# Altium schematic sheet Smartfin Main PCBA Motion.SchDoc: Motion
size Tabloid; TOCFontName: Consolas; TOCFontSize: 24; TOCFontColor: 0; TOCFontAttributes: 0; TOCMaxLinesInTable: 25; TOCVerticalOffset: 200; TOCHorizontalOffset: 500; TOCHorizontalSeparation: 800; TOCVerticalSeparation: 30; TOCHorizTableSize: 640; Engineer: Amy Domino; DocumentNumber: 644-001-023; Revision: A; SheetNumber: 4; SheetTotal: 9; PageSetup: Record=PageOptions|CenterHorizontal=True|CenterVertical=True|PrintScale=0.96|XCorrection=1.00|YCorrection=1.00|PrintKind=0|BorderSize=5000000|LeftOffset=0|BottomOffset=0|Orientation=2|PaperLength=1000|PaperWidth=1000|Scale=100|PaperSource=7|PrintQuality=-4|MediaType=1|DitherType=10|PaperKind=11" x 17"|PrintScaleMode=1
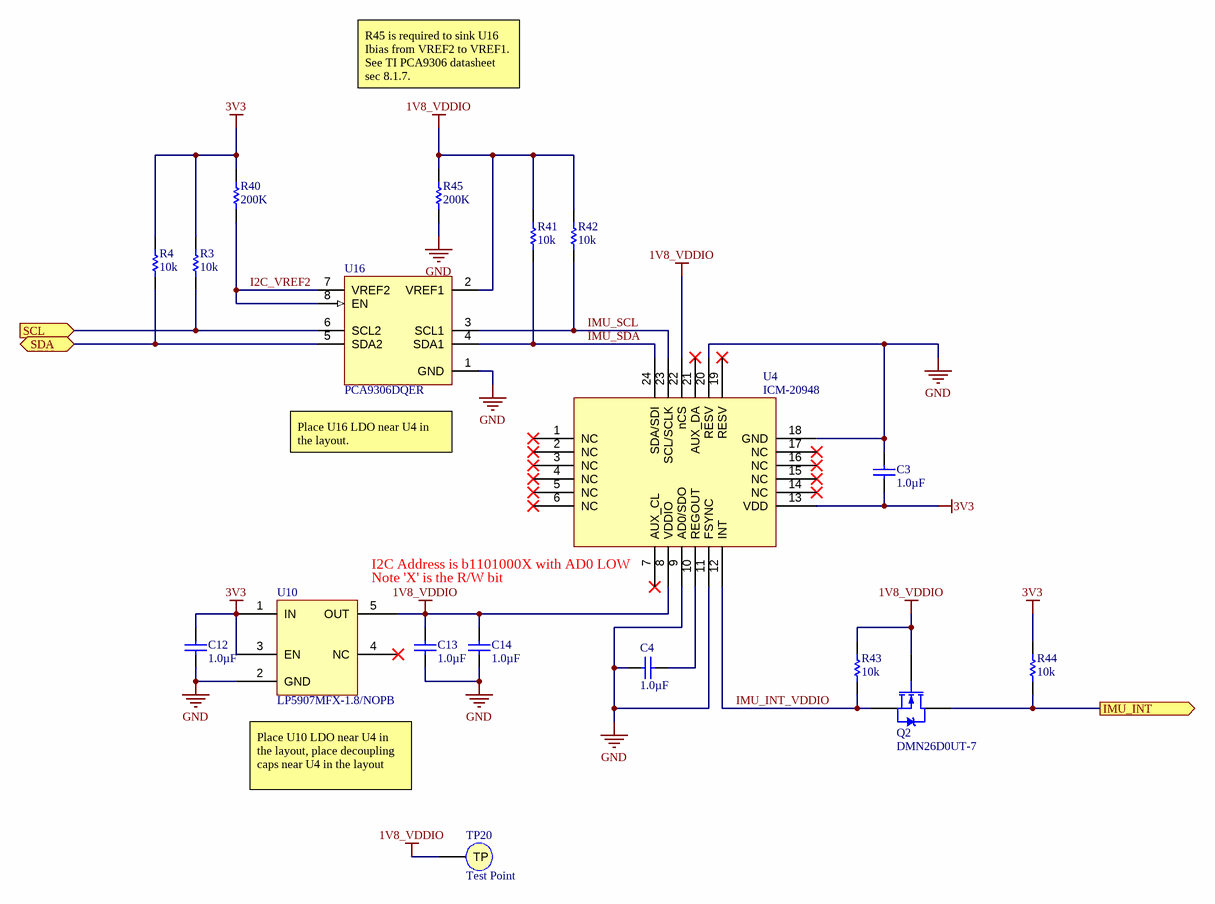
[diagram p0: Smartfin Main PCBA Motion.SchDoc]

## Parts
C3  1.0µF  [CAPC0402(1005)60_N]
C4  1.0µF  [CAPC0402(1005)60_N]
C12  1.0µF  [CAPC0402(1005)60_N]
C13  1.0µF  [CAPC0402(1005)60_N]
C14  1.0µF  [CAPC0402(1005)60_N]
Q2  DMN26D0UT-7  [DMN26D0UT-7-Footprint-1]
R3  10k  [RESC0402(1005)_N]
R4  10k  [RESC0402(1005)_N]
R40  200K  [RESC0402(1005)_N]
R41  10k  [RESC0402(1005)_N]
R42  10k  [RESC0402(1005)_N]
R43  10k  [RESC0402(1005)_N]
R44  10k  [RESC0402(1005)_N]
R45  200K  [RESC0402(1005)_N]
TP20  Test Point  [TESTPAD_ICT]  (no BOM)
U4  ICM-20948  [ICM-20948-Footprint-1]
U10  LP5907MFX-1.8/NOPB  [SOT95P280X145-5N]
U16  PCA9306DQER  [QFN35P100X140X40-8L]

## Ports
IMU_INT (out), SCL (in), SDA (bidir)

## Nets
1V8_VDDIO: C13.2 C14.2 Q2.G R41.2 R42.2 R43.2 R45.2 TP20.1(TP) U4.8(VDDIO) U4.22(nCS) U10.5(OUT) U16.2(VREF1)
3V3: C3.1 C12.2 R3.2 R4.2 R40.2 R44.2 U4.13(VDD) U10.1(IN) U10.3(EN)
GND: C3.2 C4.1 C12.1 C13.1 C14.1 R45.1 U4.9(AD0/SDO) U4.11(FSYNC) U4.18(GND) U4.20(RESV) U10.2(GND) U16.1(GND)
I2C_VREF2: R40.1 U16.7(VREF2) U16.8(EN)
IMU_INT: Q2.D R44.1 ; port IMU_INT
IMU_INT_VDDIO: Q2.S R43.1 U4.12(INT)
IMU_SCL: R42.1 U4.23(SCL/SCLK) U16.3(SCL1)
IMU_SDA: R41.1 U4.24(SDA/SDI) U16.4(SDA1)
SCL: R3.1 U16.6(SCL2) ; port SCL
SDA: R4.1 U16.5(SDA2) ; port SDA
NetC4_2: C4.2 U4.10(REGOUT)

Not connected (* = marked no-connect by the designer): U4 1(NC)* 2(NC)* 3(NC)* 4(NC)* 5(NC)* 6(NC)* 7(AUX_CL)* 14(NC)* 15(NC)* 16(NC)* 17(NC)* 19(RESV)* 21(AUX_DA)*; U10 4(NC)*

## Notes on the sheet
- R45 is required to sink U16 Ibias from VREF2 to VREF1. See TI PCA9306 datasheet sec 8.1.7.
- (near U16) Place U16 LDO near U4 in the layout.
- (near U4) I2C Address is b1101000X with AD0 LOW
- Note 'X' is the R/W bit
- (near U10) Place U10 LDO near U4 in the layout, place decoupling caps near U4 in the layout
- TITLE
- DOC NUMBER
- VARIANT
- REV
- 10875 dover st, suite 500
  westminster, co, 80021, usa
  syncroness.com
- FILE
- ENGINEER
- SHEET
- DATE
- OF
- THIS DOCUMENT IS CONFIDENTIAL AND THE PROPERTY OF SYNCRONESS, INC. AND ITS SUBSIDARIES. IT SHALL NOT BE REPRODUCED IN ANY MANNER NOR USED FOR ANY PURPOSE WHATSOEVER EXCEPT AS SPECIFIED IN WRITING BY SYNCRONESS, INC.

## Library data of the parts
C3 C4 C12-C14 = CMP-13694-A.6: CAP CER 1UF 10V 10% X5R 0402; Manufacturer: Yageo; Manufacturer Part Number: CC0402KRX5R6BB105; Manufacturer 2: Samsung Electro-Mechanics; Manufacturer 3: AVX Corporation; Manufacturer Part Number 2: CL05A105KP5NNNC; Manufacturer Part Number 3: 0402ZD105KAT2A; Operating Temperature: -55°C ~ 85°C; Supplier Part Number 1: 311-1439-1-ND; Supplier Part Number 2: 1276-1076-1-ND; Supplier Part Number 3: 478-4596-1-ND; Temperature Coefficient: X5R; Tolerance: ±10%; Capacitance: 1.0µF; Voltage - Rated: 10V; Supplier 2: Digi-Key; Supplier 3: Digi-Key; Supplier 1: Digi-Key; Datasheet: http://www.samsungsem.com/kr/support/product-search/mlcc/__icsFiles/afieldfile/2019/05/10/19-CL05A105KP5NNNC.pdf
Q2 = CMP-23815-A.1: MOSFET N-CH 20V 230MA SOT523; Manufacturer: Diodes Incorporated; Input Capacitance: 14.1pF; Max Power Dissipation: 300mW; Number of Elements: 1; Rds On Max: 3R; Rise Time: 7.9ns; Fall Time: 15.2ns; Turn-Off Delay Time: 13.4ns; Turn-On Delay Time: 3.8ns; Threshold Voltage: 1V; Element Configuration: Single; Gate to Source Voltage (Vgs): 10V; Mount: Surface Mount; Case/Package: SOT-523; Number of Pins: 3; Weight: 7.1E-05oz; Min Operating Temperature: -55°C; Max Operating Temperature: 150°C; Package Quantity: 1; Drain to Source Voltage (Vdss): 20V; Continuous Drain Current (ID): 230mA; Drain to Source Breakdown Voltage: 20V; Drain to Source Resistance: 3R; Power Dissipation: 300mW; Number of Channels: 1; On-State Resistance: 3R; Length: 1.7mm; Height: 0.8mm; Width: 0.85mm; Radiation Hardening: No; REACH SVHC: No SVHC; Lead Free: Lead Free; Manufacturer Part Number: DMN26D0UT-7; Supplier: Digi-Key; Supplier Part Number: DMN26D0UT-7DICT-ND
R3 R4 R41-R44 = CMP-15831-A.1: RES SMD 10K OHM 0.1% 1/16W 0402; Manufacturer: Panasonic Electronic Components; Manufacturer Part Number: ERA-2ARB103X; Power (Watts): 0.063W, 1/16W; Temperature Coefficient: ±10ppm/°C; Packaging: Cut Tape (CT); Part Status: Active; Resistance (Ohms): 10k; Tolerance: ±0.1%; Composition: Thin Film; Features: Automotive AEC-Q200; Operating Temperature: -55°C ~ 155°C; Package / Case: 0402 (1005 Metric); Supplier Device Package: 0402; Size / Dimension: 0.039" L x 0.020" W (1.00mm x 0.50mm); Height - Seated (Max): 0.016" (0.40mm); Failure Rate: -; Supplier: Digi-Key; Supplier Part Number: P10KCPCT-ND; ComponentLink1Description: Datasheet; ComponentLink1URL: https://industrial.panasonic.com/cdbs/www-data/pdf/RDM0000/AOA0000C237.pdf
R40 R45 = CMP-10579-A.1: RES 200K OHM 1/16W 5% 0402 SMD; Manufacturer: Yageo; Manufacturer Part Number: RC0402JR-07200KL; Temperature Coefficient: ±100ppm/°C; Resistance: 200K; Supplier Part Number 1: 311-200KJRCT-ND; Tolerance: 5%; Wattage: 1/16 W; Composition: Thick Film; Supplier 1: Digikey; Supplier 4: Digikey; Supplier 2: Digikey; Supplier 3: Digikey; Supplier 5: Digikey
TP20 = CMP-08242-A.3: ICT Test Point
U4 = CMP-23688-A.7: IMU ACCEL/GYRO/COMPI2C/SPI 24QFN; Manufacturer: TDK InvenSense; Sensor Type: Accelerometer,Gyroscope,Magnetometer; Output Type: SPI,I2C; Mount: Surface Mount; Case/Package: QFN; Min Operating Temperature: -40°C; Max Operating Temperature: 85°C; Packaging: Tape and Reel; Manufacturer Part Number: ICM-20948; Supplier: Digi-Key; Supplier Part Number: 1428-1123-1-ND
U10 = CMP-23434-A.4: IC REG LDO 1.8V 0.25A SOT23-5; Manufacturer: Texas Instruments; Min Input Voltage: 2.2V; Dropout Voltage: 250mV; Max Input Voltage: 5.5V; Output Current: 250mA; Polarity: Positive; Quiescent Current: 25uA; Power Supply Rejection Ratio (PSRR): 82dB; Accuracy: 2%; Case/Package: SOT-23; Contact Plating: Tin; Min Operating Temperature: -40°C ~ 125°C; Output Voltage: 1.8V; Nominal Output Voltage: 1.8V; Max Output Current: 250mA; REACH SVHC: No SVHC; Datasheet: http://www.ti.com/lit/ds/symlink/lp5907.pdf; Manufacturer Part Number: LP5907MFX-1.8/NOPB; Supplier: Digi-Key; Supplier Part Number: 296-41463-1-ND
U16 = CMP-06761-4: IC V-LEVL XLATR I2C/SMBUS 8X2SON; Manufacturer: Texas Instruments; Logic Function: Translator, Bidirectional, Open Drain; Number of Bits: 2; Output Type: I²C™/SMBus™; Number of Outputs/Channel: 1; Differential - Input:Output: No/No; Propagation Delay (Max): 0.3ns; Voltage - Supply: 1.2 V ~ 3.3 V, 1.8 V ~ 5.5 V; Supplier 1: Digi-Key; Supplier Part Number 1: 296-27957-1-ND; RoHS: RoHS Compliant; Category: Integrated Circuits (ICs); Stock: 18548; Pricing: 1=0.94, 10=0.829, 25=0.7488, 100=0.6552, 250=0.5746, 500=0.5096, 1000=0.403, 2500=0.3744 (USD); Packaging: Cut Tape (CT); Input Type: I2C/SMBus; Data Rate: -; Number of Channels: 2; Operating Temperature: -40°C ~ 85°C; Package / Case: 8-XFDFN; Supplier Device Package: 8-X2SON (1.4x1.0); Mounting Type: Surface Mount; ComponentLink1URL: http://www.ti.com/lit/ds/symlink/pca9306.pdf; ComponentLink1Description: Datasheet; Manufacturer Part Number: PCA9306DQER